# EasyEDA schematic EasyEDA_SCH_Nanosec Shifter_2022-09-27.json
TITLE: Nanosec Shifter; REV: 1.0; Date: 2022-09-26; Sheet: 1/1; Drawn By: Stephen Zhang; Company: Stephen Zhang
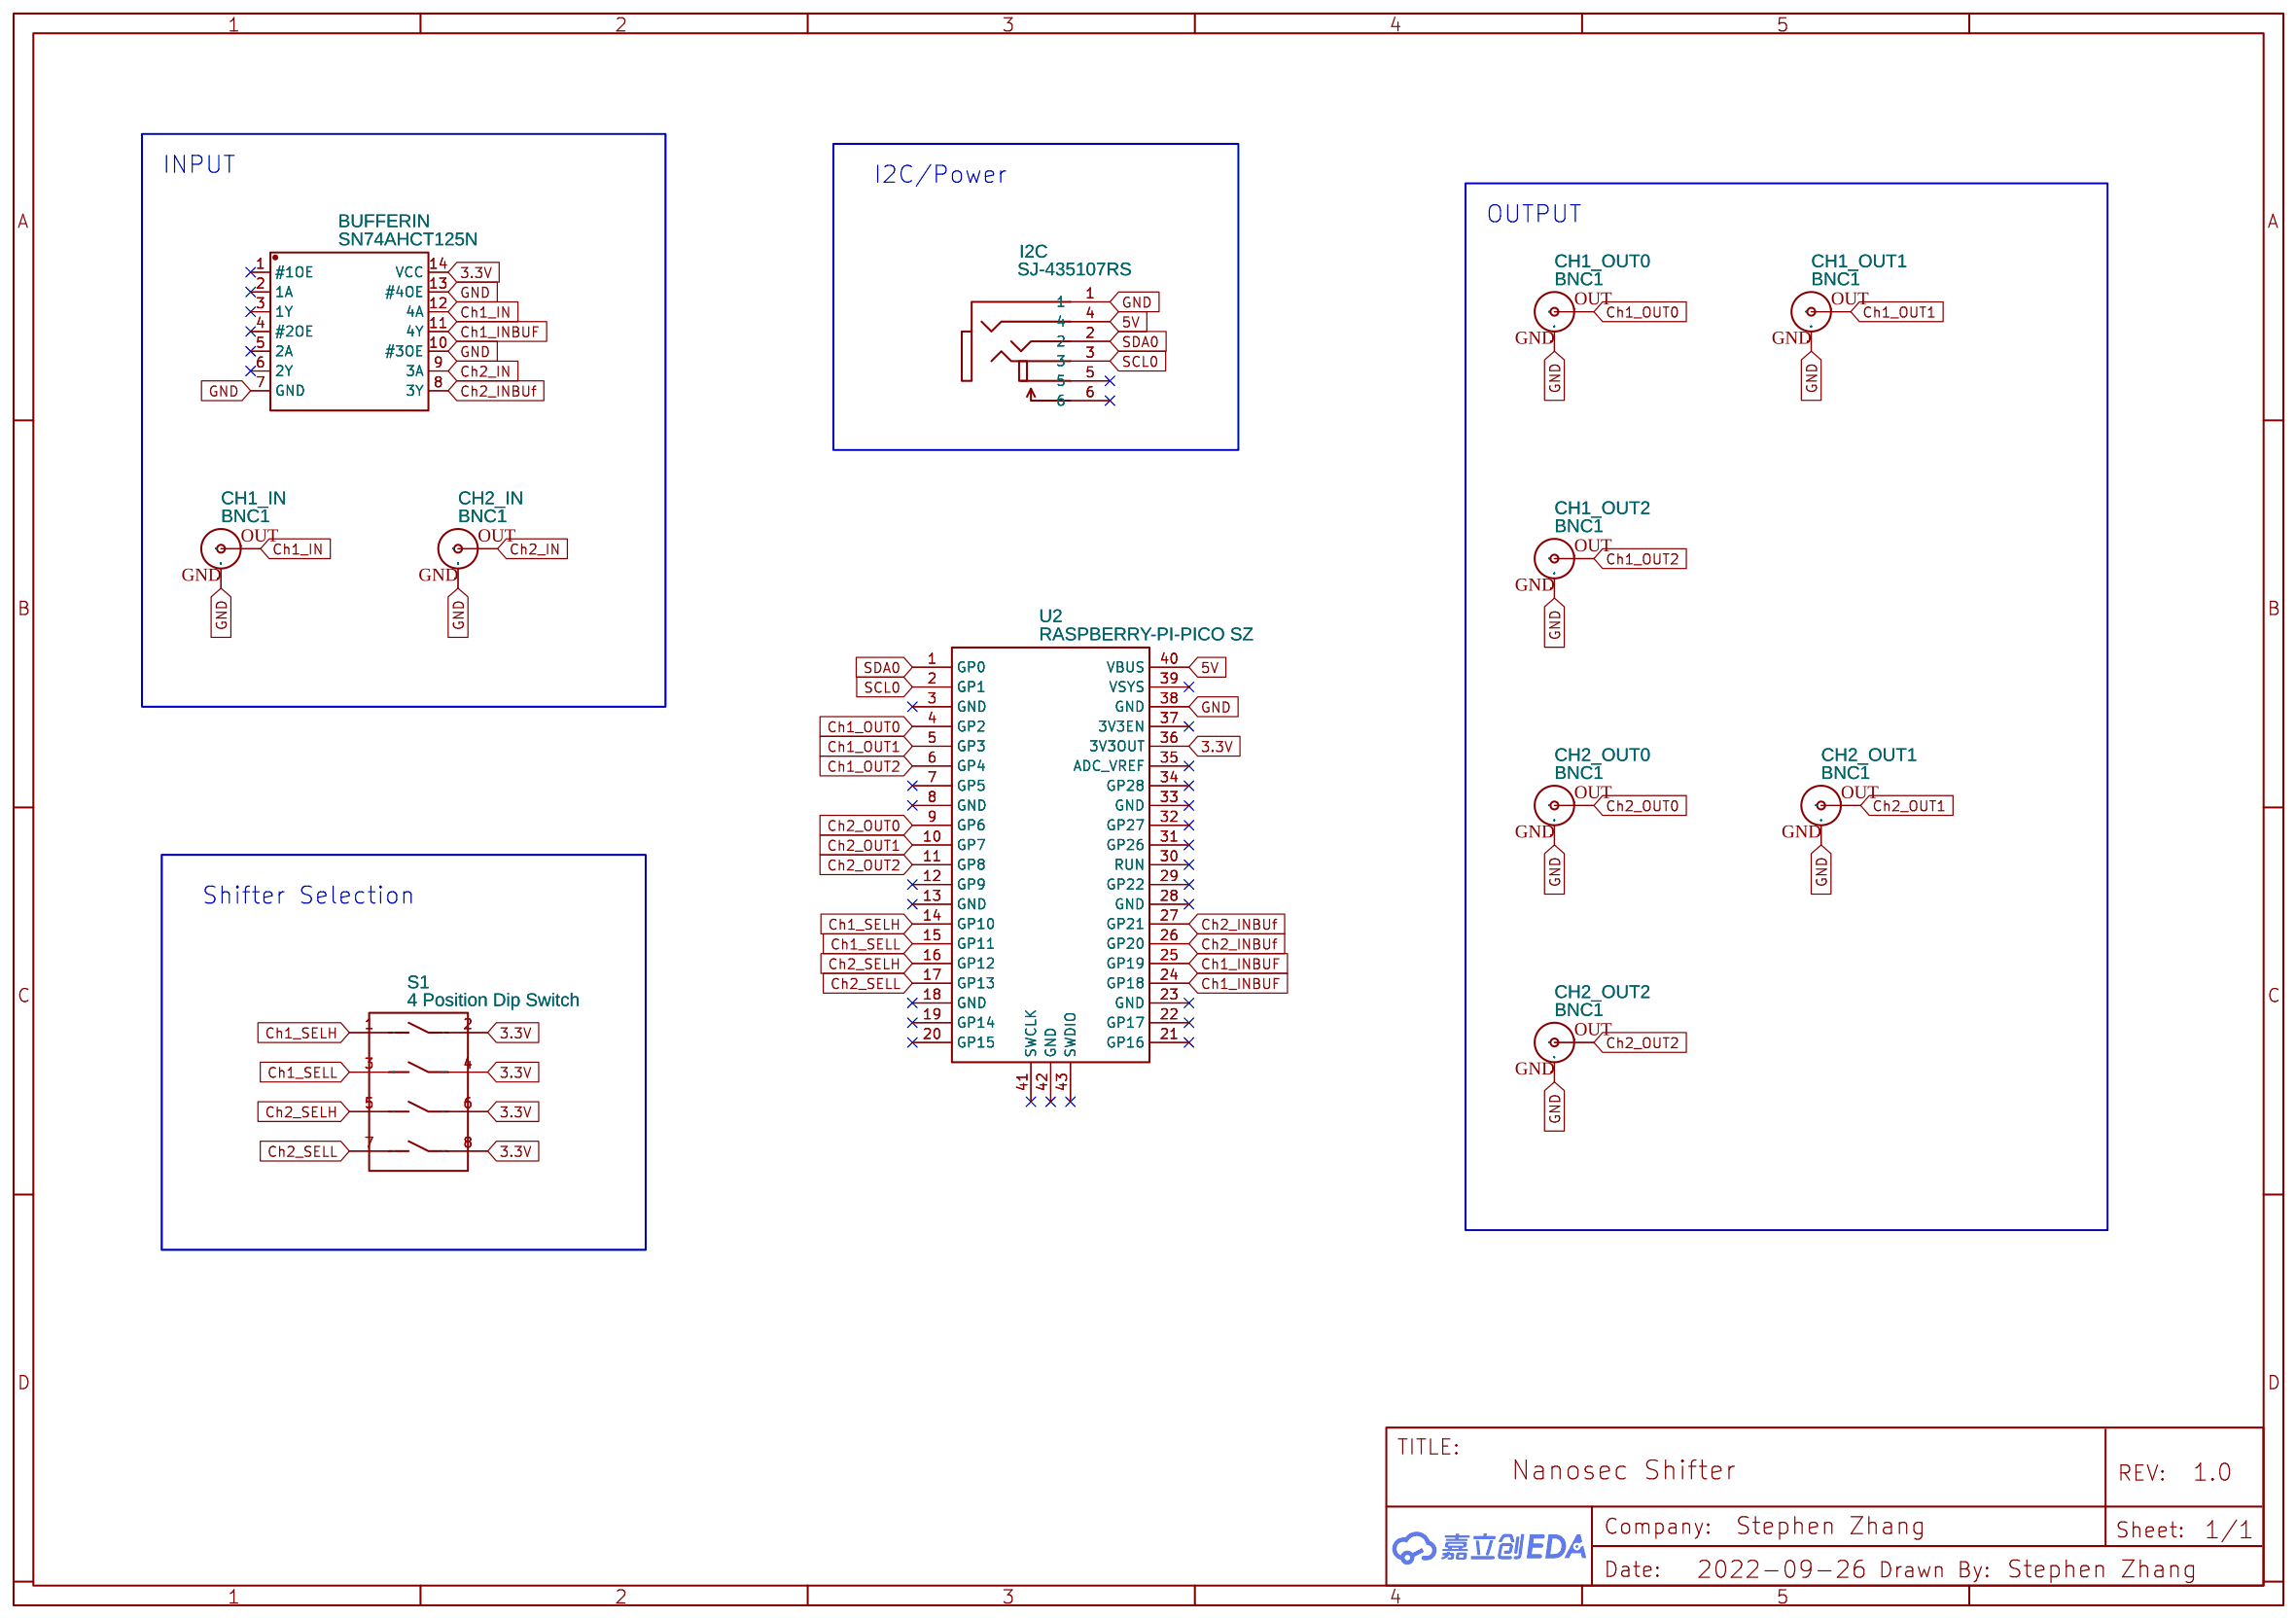
[diagram p0: schematic sheet]

## Parts
BUFFERIN  SN74AHCT125N  [PDIP-14_L19.3-W6.4-P2.54-LS7.6-BL]
CH1_IN  BNC1  [BNC1]
CH1_OUT0  BNC1  [BNC1]
CH1_OUT1  BNC1  [BNC1]
CH1_OUT2  BNC1  [BNC1]
CH2_IN  BNC1  [BNC1]
CH2_OUT0  BNC1  [BNC1]
CH2_OUT1  BNC1  [BNC1]
CH2_OUT2  BNC1  [BNC1]
I2C  SJ-435107RS  [SJ-435107RS]
S1  4 Position Dip Switch  [4 POSITION DIP SWITCH]
U2  RASPBERRY-PI-PICO SZ  [RASPBERRY-PI-PICO]

## Library data of the parts
BUFFERIN = SN74AHCT125N: Supplier: LCSC; Supplier Part: C354152; Manufacturer: Texas Instruments; Contributor: LCSC; JLCPCB Part Class: Extended Part
CH1_IN CH1_OUT0-CH1_OUT2 CH2_IN CH2_OUT0-CH2_OUT2 = BNC1: Contributor: serejkabezne
I2C = SJ-435107RS: Supplier Part: 490-SJ-435107RS; Supplier: Mouser; link: http://www.mouser.com/ds/2/670/sj-435107-535541.pdf; Contributor: EPDC
S1 = 4 Position Dip Switch: Manufacturer: CTS Electronic Components; Manufacturer Part: 206-4LPST; link: https://www.mouser.com/ProductDetail/CTS-Electronic-Components/206-8LPST?qs=Mr%252BgrRYddfp4vF4bUGCzwQ%3D%3D; Contributor: abell6723
U2 = RASPBERRY-PI-PICO SZ: Contributor: palaciosj01

## Nets
3.3V: BUFFERIN.14(VCC) S1.2 S1.4 S1.6 S1.8 U2.36(3V3OUT)
5V: I2C.4 U2.40(VBUS)
GND: BUFFERIN.7(GND) BUFFERIN.10(#3OE) BUFFERIN.13(#4OE) CH1_IN.GND CH1_OUT0.GND CH1_OUT1.GND CH1_OUT2.GND CH2_IN.GND CH2_OUT0.GND CH2_OUT1.GND CH2_OUT2.GND I2C.1 U2.38(GND)
Ch1_IN: BUFFERIN.12(4A) CH1_IN.S(OUT)
Ch1_INBUF: BUFFERIN.11(4Y) U2.24(GP18) U2.25(GP19)
Ch1_OUT0: CH1_OUT0.S(OUT) U2.4(GP2)
Ch1_OUT1: CH1_OUT1.S(OUT) U2.5(GP3)
Ch1_OUT2: CH1_OUT2.S(OUT) U2.6(GP4)
Ch1_SELH: S1.1 U2.14(GP10)
Ch1_SELL: S1.3 U2.15(GP11)
Ch2_IN: BUFFERIN.9(3A) CH2_IN.S(OUT)
Ch2_INBUf: BUFFERIN.8(3Y) U2.26(GP20) U2.27(GP21)
Ch2_OUT0: CH2_OUT0.S(OUT) U2.9(GP6)
Ch2_OUT1: CH2_OUT1.S(OUT) U2.10(GP7)
Ch2_OUT2: CH2_OUT2.S(OUT) U2.11(GP8)
Ch2_SELH: S1.5 U2.16(GP12)
Ch2_SELL: S1.7 U2.17(GP13)
SCL0: I2C.3 U2.2(GP1)
SDA0: I2C.2 U2.1(GP0)

Not connected (* = marked no-connect by the designer): BUFFERIN 1(#1OE)* 2(1A)* 3(1Y)* 4(#2OE)* 5(2A)* 6(2Y)*; I2C 5* 6*; U2 3(GND)* 7(GP5)* 8(GND)* 12(GP9)* 13(GND)* 18(GND)* 19(GP14)* 20(GP15)* 21(GP16)* 22(GP17)* 23(GND)* 28(GND)* 29(GP22)* 30(RUN)* 31(GP26)* 32(GP27)* 33(GND)* 34(GP28)* 35(ADC_VREF)* 37(3V3EN)* 39(VSYS)* 41(SWCLK)* 42(GND)* 43(SWDIO)*

## Notes on the sheet
- INPUT
- I2C/Power
- OUTPUT
- Shifter Selection
